# Altium project GCS.PrjPcb
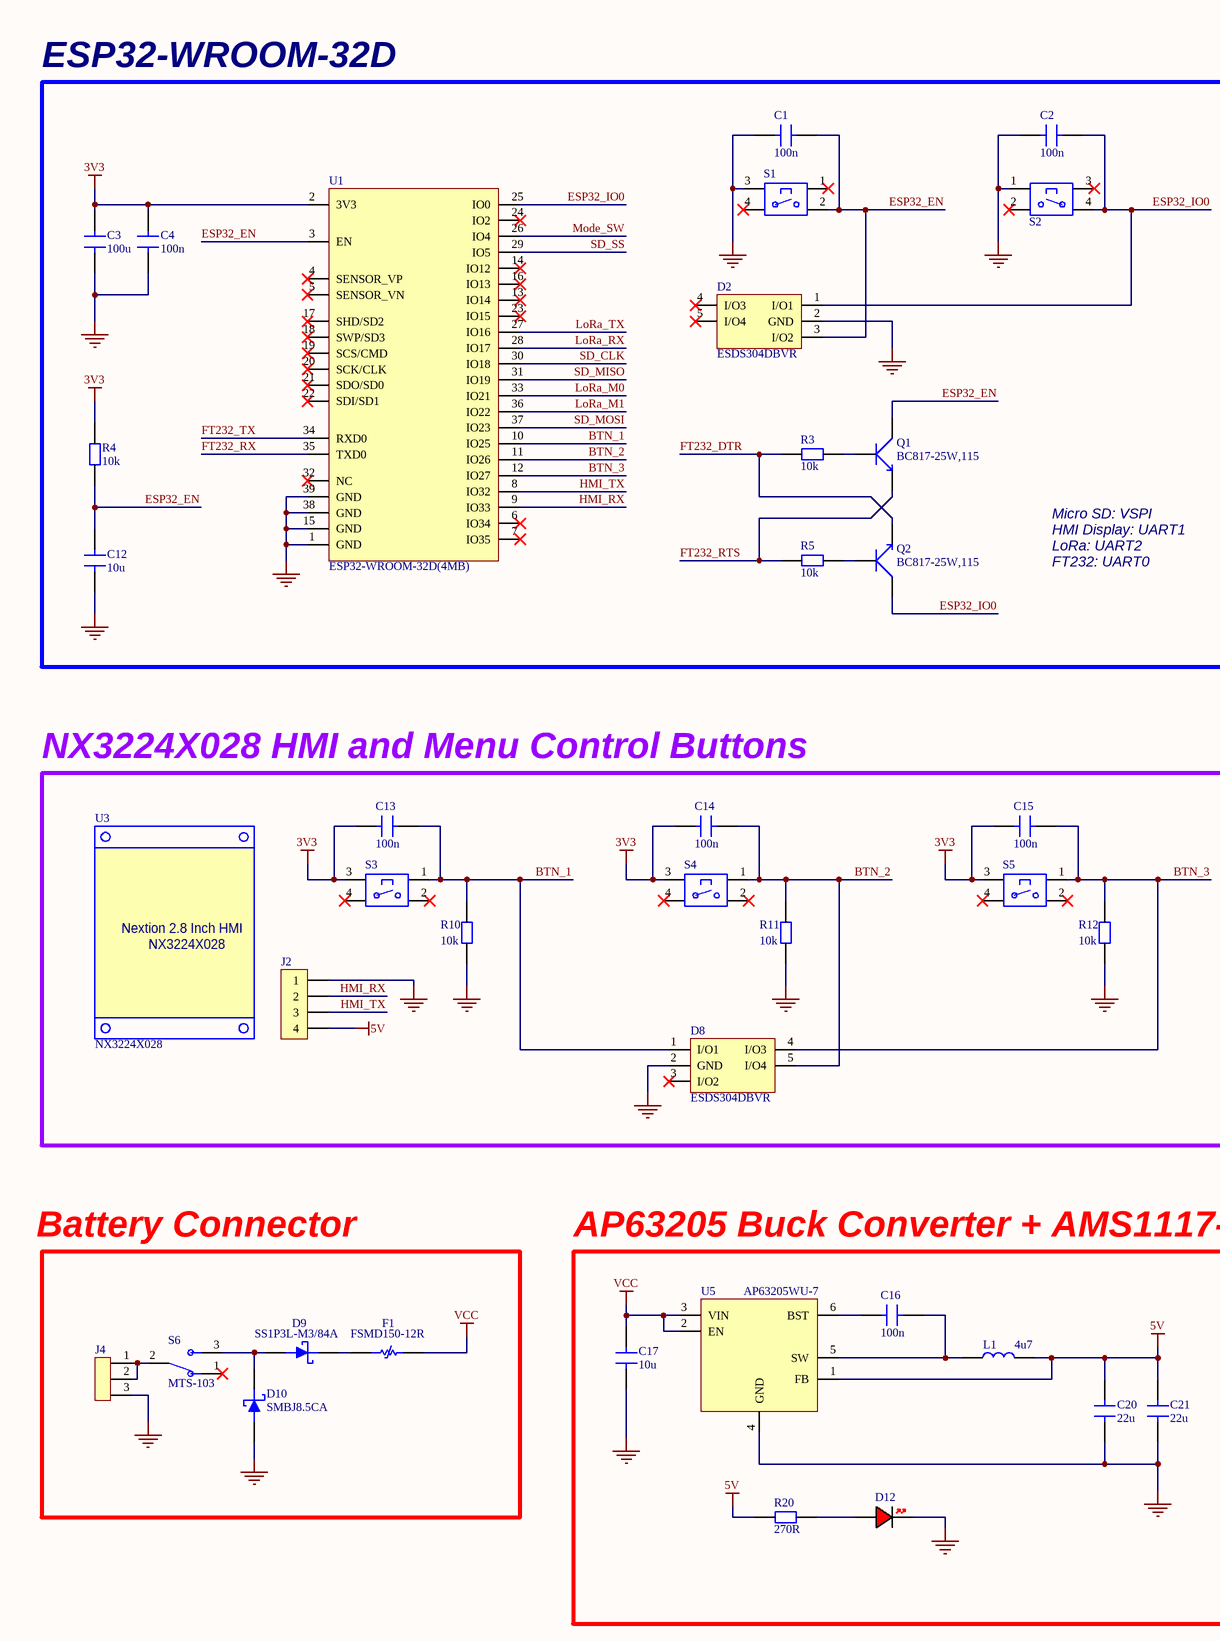
[diagram p0: MainRevB.SchDoc, left]
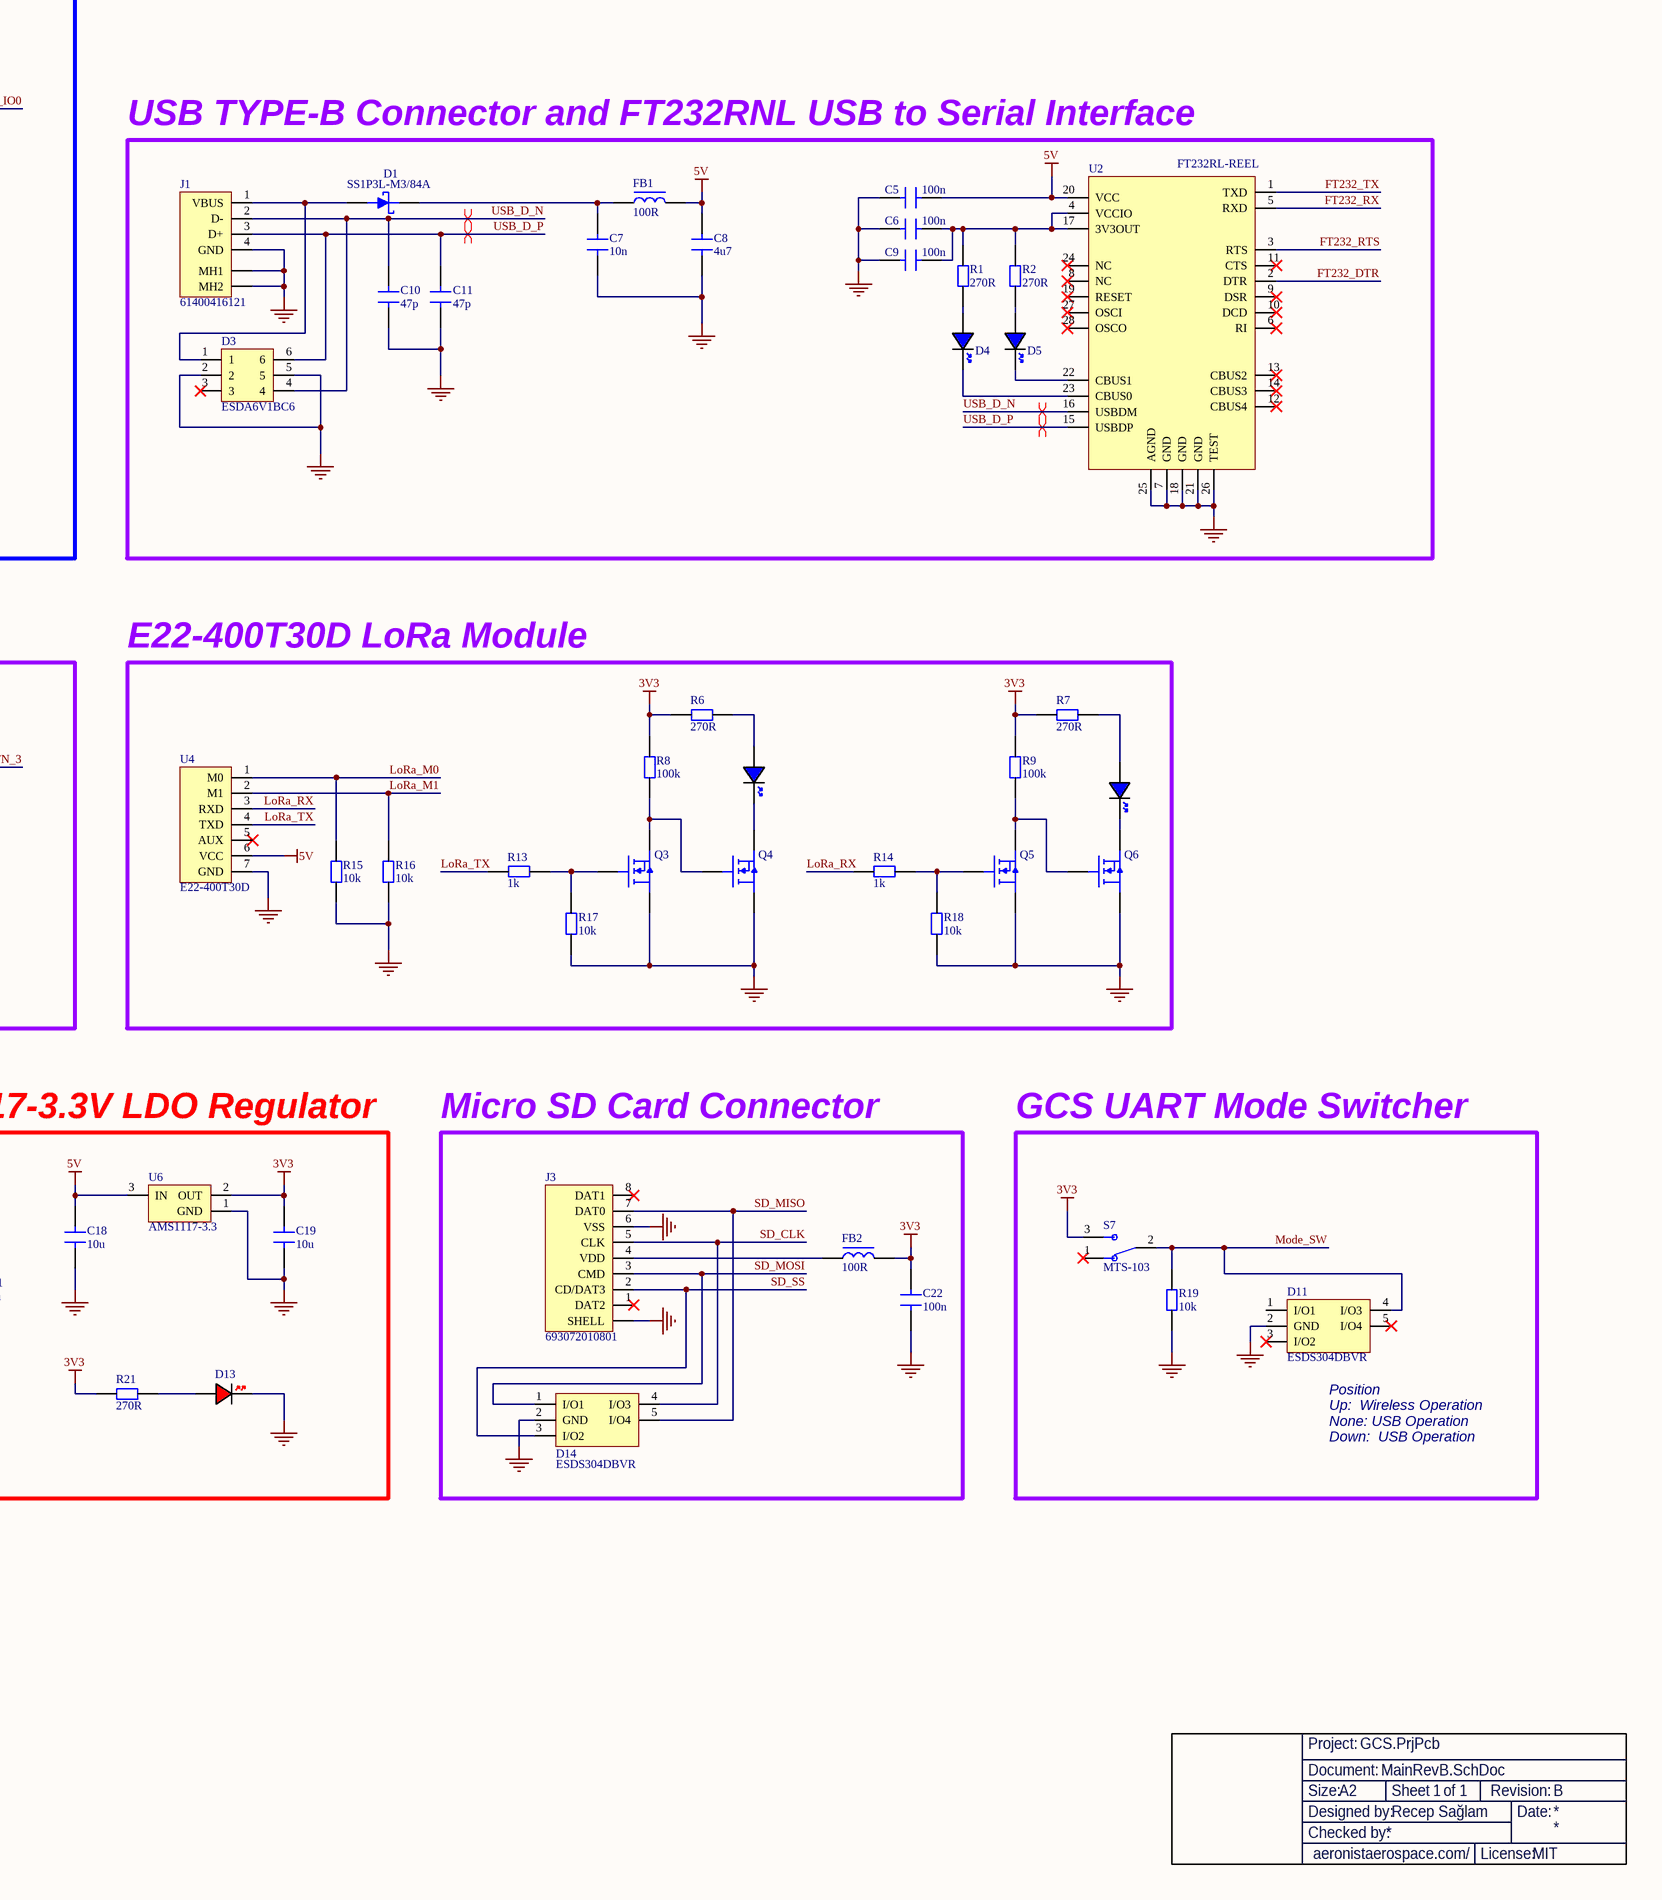
[diagram p1: MainRevB.SchDoc, right]
DrawnBy: Recep Sağlam; License: MIT; Revision: B; Size: A2
1 sheet, 85 parts. Net scope: global (net labels, ports and power ports of the same name join across sheets).
Board file: GCS.PcbDoc

## Sheet MainRevB.SchDoc
size A2; SheetNumber: 1; SheetTotal: 1

### Parts
?  Title Block  (value not drawn)  (graphical)
C1  100n  [CAP 0805]
C2  100n  [CAP 0805]
C3  100u  [CAP 1210]
C4  100n  [CAP 0805]
C5  100n  [CAP 0805]
C6  100n  [CAP 0805]
C7  10n  [CAP 0805]
C8  4u7  [CAP 0805]
C9  100n  [CAP 0805]
C10  47p  [CAP 0805]
C11  47p  [CAP 0805]
C12  10u  [CAP 1210]
C13  100n  [CAP 0805]
C14  100n  [CAP 0805]
C15  100n  [CAP 0805]
C16  100n  [CAP 0805]
C17  10u  [CAP 1210]
C18  10u  [CAP 1210]
C19  10u  [CAP 1210]
C20  22u  [CAP 1210]
C21  22u  [CAP 1210]
C22  100n  [CAP 0805]
D1  SS1P3L-M3/84A  [SS1P3L]
D2  ESDS304DBVR  [SOT-23-5]
D3  ESDA6V1BC6  [SOT-23-6]
D4  LED 0805 BLUE  [LED 0805 BLUE]  (value not drawn)
D5  LED 0805 BLUE  [LED 0805 BLUE]  (value not drawn)
D6  LED 0805 BLUE  [LED 0805 BLUE]  (value not drawn)
D7  LED 0805 BLUE  [LED 0805 BLUE]  (value not drawn)
D8  ESDS304DBVR  [SOT-23-5]
D9  SS1P3L-M3/84A  [SS1P3L]
D10  SMBJ8.5CA  [SMBJ12CA-13-F]
D11  ESDS304DBVR  [SOT-23-5]
D12  LED 0805 RED  [LED 0805 RED]  (value not drawn)
D13  LED 0805 RED  [LED 0805 RED]  (value not drawn)
D14  ESDS304DBVR  [SOT-23-5]
F1  FSMD150-12R  [0ZCG0075FF2C]
FB1  100R  [FB 0805]
FB2  100R  [FB 0805]
J1  61400416121  [61400416121]
J2  JST S4B-PH  [JST_S4B-PH]  (value not drawn)
J3  693072010801  [693072010801]
J4  KF301 3P Terminal  [KF301 3P]  (value not drawn)
L1  4u7  [IHLP2020CZER4R7M11]
Q1  BC817-25W,115  [BC817-25]
Q2  BC817-25W,115  [BC817-25]
Q3  IRLML6344TRPBF  [BC817-25]  (value not drawn)
Q4  IRLML6344TRPBF  [BC817-25]  (value not drawn)
Q5  IRLML6344TRPBF  [BC817-25]  (value not drawn)
Q6  IRLML6344TRPBF  [BC817-25]  (value not drawn)
R1  270R  [RES 0805]
R2  270R  [RES 0805]
R3  10k  [RES 0805]
R4  10k  [RES 0805]
R5  10k  [RES 0805]
R6  270R  [RES 0805]
R7  270R  [RES 0805]
R8  100k  [RES 0805]
R9  100k  [RES 0805]
R10  10k  [RES 0805]
R11  10k  [RES 0805]
R12  10k  [RES 0805]
R13  1k  [RES 0805]
R14  1k  [RES 0805]
R15  10k  [RES 0805]
R16  10k  [RES 0805]
R17  10k  [RES 0805]
R18  10k  [RES 0805]
R19  10k  [RES 0805]
R20  270R  [RES 0805]
R21  270R  [RES 0805]
S1  FSM4JSMATR  [FSM4JSMATR]  (value not drawn)
S2  FSM4JSMATR  [FSM4JSMATR]  (value not drawn)
S3  FSM4JSMATR  [FSM4JSMATR]  (value not drawn)
S4  FSM4JSMATR  [FSM4JSMATR]  (value not drawn)
S5  FSM4JSMATR  [FSM4JSMATR]  (value not drawn)
S6  MTS-103  [MTS-103]
S7  MTS-103  [MTS-103]
U1  ESP32-WROOM-32D(4MB)  [ESP32-WROOM-32]
U2  FT232RL-REEL  [FT232RL]
U3  NX3224X028  [NX32224X028]
U4  E22-400T30D  [LORA E220-400T30D]
U5  AP63205WU-7  [AP63205]
U6  AMS1117-3.3  [SOT-223]

### Blocks framed on the sheet
ESP32-WROOM-32D: C1-C4 C12 D2 Q1 Q2 R3-R5 S1 S2 U1
USB TYPE-B Connector and FT232RNL USB to Serial Interface: C5-C11 D1 D3-D5 FB1 J1 R1 R2 U2
NX3224X028 HMI and Menu Control Buttons: C13-C15 D8 J2 R10-R12 S3-S5
E22-400T30D LoRa Module: D6 D7 Q3-Q6 R6-R9 R13-R18 U4
AP63205 Buck Converter + AMS1117-3.3V LDO Regulator: C16-C21 D12 D13 L1 R20 R21 U5 U6
Micro SD Card Connector: C22 D14 FB2 J3
GCS UART Mode Switcher: D11 R19 S7

### Nets
3V3: C3.2 C4.2 C13.2 C14.1 C15.2 C19.2 C22.1 FB2.2 R4.2 R6.2 R7.2 R8.2 R9.2 R21.1 S3.3 S4.3 S5.3 S7.3 U1.2(3V3) U6.2(OUT)
5V: C5.1 C8.2 C18.2 C20.2 C21.2 FB1.2 J2.4 L1.2 R20.1 U2.20(VCC) U4.6(VCC) U5.1(FB) U6.3(IN)
GND: C1.2 C2.2 C3.1 C4.1 C5.2 C6.2 C7.1 C8.1 C9.2 C10.1 C11.1 C12.1 C17.1 C18.1 C19.1 C20.1 C21.1 C22.2 D2.2(GND) D3.2 D3.5 D8.2(GND) D10.1 D11.2(GND) D12.K D13.K D14.2(GND) J1.4(GND) J1.Shell(MH1) J2.1 J3.6(VSS) J3.SHELL J4.3 Q3.2(S) Q4.2(S) Q5.2(S) Q6.2(S) R10.2 R11.2 R12.2 R15.1 R16.1 R17.2 R18.2 R19.1 S1.3 S2.1 U1.1(GND) U1.15(GND) U1.38(GND) U1.39(GND) U2.7(GND) U2.18(GND) U2.21(GND) U2.25(AGND) U2.26(TEST) U4.7(GND) U5.4(GND) U6.1(GND)
VCC: C17.2 F1.2 U5.2(EN) U5.3(VIN)
BTN_1: C13.1 D8.1(I/O1) R10.1 S3.1 U1.10(IO25)
BTN_2: C14.2 D8.5(I/O4) R11.1 S4.1 U1.11(IO26)
BTN_3: C15.1 D8.4(I/O3) R12.1 S5.1 U1.12(IO27)
ESP32_EN: C1.1 C12.2 D2.3(I/O2) Q1.3(C) R4.1 S1.2 U1.3(EN)
ESP32_IO0: C2.1 D2.1(I/O1) Q2.3(C) S2.4 U1.25(IO0)
FT232_DTR: Q2.2(E) R3.2 U2.2(DTR)
FT232_RTS: Q1.2(E) R5.2 U2.3(RTS)
FT232_RX: U1.35(TXD0) U2.5(RXD)
FT232_TX: U1.34(RXD0) U2.1(TXD)
HMI_RX: J2.2 U1.9(IO33)
HMI_TX: J2.3 U1.8(IO32)
LoRa_M0: R15.2 U1.33(IO21) U4.1(M0)
LoRa_M1: R16.2 U1.36(IO22) U4.2(M1)
LoRa_RX: R14.2 U1.28(IO17) U4.3(RXD)
LoRa_TX: R13.2 U1.27(IO16) U4.4(TXD)
Mode_SW: D11.4(I/O3) R19.2 S7.2 U1.26(IO4)
SD_CLK: D14.4(I/O3) J3.5(CLK) U1.30(IO18)
SD_MISO: D14.5(I/O4) J3.7(DAT0) U1.31(IO19)
SD_MOSI: D14.1(I/O1) J3.3(CMD) U1.37(IO23)
SD_SS: D14.3(I/O2) J3.2(CD/DAT3) U1.29(IO5)
USB_D_N: C10.2 D3.4 J1.2(D-) U2.16(USBDM)
USB_D_P: C11.2 D3.6 J1.3(D+) U2.15(USBDP)
NetC6_1: C6.1 C9.1 R1.1 R2.1 U2.4(VCCIO) U2.17(3V3OUT)
NetC7_2: C7.2 D1.1 FB1.1
NetC16_1: C16.1 L1.1 U5.5(SW)
NetC16_2: C16.2 U5.6(BST)
NetD1_2: D1.2 D3.1 J1.1(VBUS)
NetD4_A: D4.A R1.2
NetD4_K: D4.K U2.23(CBUS0)
NetD5_A: D5.A R2.2
NetD5_K: D5.K U2.22(CBUS1)
NetD6_A: D6.A R6.1
NetD6_K: D6.K Q4.3(D)
NetD7_A: D7.A R7.1
NetD7_K: D7.K Q6.3(D)
NetD9_1: D9.1 F1.1
NetD9_2: D9.2 D10.2 S6.3
NetD12_A: D12.A R20.2
NetD13_A: D13.A R21.2
NetFB2_1: FB2.1 J3.4(VDD)
NetJ4_1: J4.1 J4.2 S6.2
NetQ1_1: Q1.1(B) R3.1
NetQ2_1: Q2.1(B) R5.1
NetQ3_1: Q3.1(G) R13.1 R17.1
NetQ3_3: Q3.3(D) Q4.1(G) R8.1
NetQ5_1: Q5.1(G) R14.1 R18.1
NetQ5_3: Q5.3(D) Q6.1(G) R9.1

Not connected (* = marked no-connect by the designer): D2 4(I/O3)* 5(I/O4)*; D3 3*; D8 3(I/O2)*; D11 1(I/O1) 3(I/O2)* 5(I/O4)*; J3 1(DAT2)* 8(DAT1)*; S1 1* 4*; S2 2* 3*; S3 2* 4*; S4 2* 4*; S5 2* 4*; S6 1*; S7 1*; U1 4(SENSOR_VP)* 5(SENSOR_VN)* 6(IO34)* 7(IO35)* 13(IO14)* 14(IO12)* 16(IO13)* 17(SHD/SD2)* 18(SWP/SD3)* 19(SCS/CMD)* 20(SCK/CLK)* 21(SDO/SD0)* 22(SDI/SD1)* 23(IO15)* 24(IO2)* 32(NC)*; U2 6(RI)* 8(NC)* 9(DSR)* 10(DCD)* 11(CTS)* 12(CBUS4)* 13(CBUS2)* 14(CBUS3)* 19(RESET)* 24(NC)* 27(OSCI)* 28(OSCO)*; U4 5(AUX)*

### Layout directives
differential pair; differential pair class DIFF_USB: USB_D_N, USB_D_P

### Notes on the sheet
- Micro SD: VSPI
- HMI Display: UART1
- LoRa: UART2
- FT232: UART0
- Battery Connector
- (near D11) Position
- Up:  Wireless Operation
- None: USB Operation
- Down:  USB Operation
- (in symbol NX3224X028) Nextion 2.8 Inch HMI
- (in symbol Title Block) Project:; Document:; Size:; Sheet; of; Revision:; Designed by:; Date:; Checked by:; aeronistaerospace.com/; License:

### Library data of the parts
C1 C2 C4-C11 C13-C16 C22 = CAP 0805 50V: Capacitor SMD 0805 50V
C3 = CAP 1210 25V: Capacitor SMD 1210 6V3
C12 C17-C19 = CAP 1210 50V: Capacitor SMD 1210 50V
C20 C21 = CAP 1210 25V: Capacitor SMD 1210 25V
D1 D9 = SS1P3L-M3/84A: Rectifier Diode, Schottky, 1 Phase, 1 Element, 1.5A, 30V V(RRM), Silicon, DO-220AA; Manufacturer: Vishay Semiconductors; Supplier 1: Mouser; Manufacturer Part Number: SS1P3L-M3/84A; RoHS: Yes; Category: Rectifier Diodes; Stock 1: 18484; Pricing 1: 1=0,46, 10=0,299, 50=0,299, 100=0,164, 1000=0,14, 10000=0,103 (USD); Reverse Voltage: 30V; ComponentLink1URL: https://datasheet.ciiva.com/16217/ss1p3l-16217789.pdf?src-supplier=Future+Electronics; ComponentLink1Description: https://datasheet.ciiva.com/16217/ss1p3l-16217789.pdf?src-supplier=Future+Electronics
D2 D8 D11 D14 = ESDS304DBVR: Trans Voltage Suppressor Diode, 85W, 3.6V V(RWM), Unidirectional, 4 Element, Silicon; Manufacturer: Texas Instruments; Supplier: Mouser; Supplier Part Number: 595-ESDS304DBVR; Manufacturer Part Number: ESDS304DBVR; RoHS: Yes; Category: TVS Diodes; Stock: 132; Pricing: 1=0,45, 10=0,304, 50=0,304, 100=0,282, 1000=0,202, 10000=0,15 (USD); Terminal Finish: Tin; JESD-609 Code: e3; Diode Type: TRANS VOLTAGE SUPPRESSOR; Moisture Sensitivity Level: 1; Reach SVHC Compliant: Yes; RoHS Compliant: Yes; ComponentLink1URL: https://www.ti.com:443/lit/ds/symlink/esds302.pdf?src-supplier=IHS+Markit; ComponentLink1Description: https://www.ti.com:443/lit/ds/symlink/esds302.pdf?src-supplier=IHS+Markit; ComponentLink2URL: http://www.ti.com/lit/ds/symlink/esds302.pdf?src-supplier=Digikey; ComponentLink2Description: http://www.ti.com/lit/ds/symlink/esds302.pdf?src-supplier=Digikey
D3 = ESDA6V1BC6: Trans Voltage Suppressor Diode, 80W, 5V V(RWM), Bidirectional, 4 Element, Silicon; Manufacturer: STMicroelectronics; Package Body Material: Plastic; Max Breakdown Voltage: 8V; Min Breakdown Voltage: 6.1V; Number of Elements: 4; Time @ Peak Reflow Temperature-Max (s): 30s; Qualification Status: Not Qualified; Supplier: Arrow Electronics; Supplier Part Number: ESDA6V1BC6; Manufacturer Part Number: ESDA6V1BC6; RoHS: Yes; Category: TVS Diodes; Stock: 84000; Pricing: 3000=0,1532 (USD); Pins: 6; Diode Element Material: SILICON; Package Shape: Rectangular; Terminal Finish: Nickel; Max Operating Temperature: 150°C; JESD-609 Code: e4; Polarity: Bidirectional; Diode Type: TRANS VOLTAGE SUPPRESSOR; JESD-30 Code: R-PDSO-G6; Moisture Sensitivity Level: 1; Non-rep Peak Rev Power Dis-Max: 80W; Package Style: SMALL OUTLINEMeter; Peak Reflow Temperature (Cel): 260°C; Rep Pk Reverse Voltage-Max: 5V; Surface Mount: Yes; Technology: AVALANCHE; Terminal Form: Gull Wing; Terminal Position: DUAL; Reach SVHC Compliant: Yes; RoHS Compliant: Yes; ComponentLink1URL: https://datasheet.ciiva.com:443/pdfs/VipMasterIC/IC/SGST/SGSTS47549/SGSTS47549-1.pdf?src-supplier=IHS+Markit; ComponentLink1Description: https://datasheet.ciiva.com:443/pdfs/VipMasterIC/IC/SGST/SGSTS47549/SGSTS47549-1.pdf?src-supplier=IHS+Markit; ComponentLink2URL: https://datasheet.ciiva.com/14186/esda6v1bc6-st-eng-tds-14186554.pdf?src-supplier=Distrelec; ComponentLink2Description: https://datasheet.ciiva.com/14186/esda6v1bc6-st-eng-tds-14186554.pdf?src-supplier=Distrelec; ComponentLink3URL: https://datasheet.ciiva.com/4507/cd00001906-94538-4507893.pdf?src-supplier=Mouser; ComponentLink3Description: https://datasheet.ciiva.com/4507/cd00001906-94538-4507893.pdf?src-supplier=Mouser; ComponentLink4URL: https://datasheet.ciiva.com/15143/getdatasheetpartid-148472-15143793.pdf?src-supplier=Verical; ComponentLink4Description: https://datasheet.ciiva.com/15143/getdatasheetpartid-148472-15143793.pdf?src-supplier=Verical; ComponentLink5URL: https://datasheet.ciiva.com/7662/1671767-7662124.pdf?src-supplier=Element14; ComponentLink5Description: https://datasheet.ciiva.com/7662/1671767-7662124.pdf?src-supplier=Element14; ComponentLink6URL: https://datasheet.ciiva.com/338/cd00001906-338704.pdf?src-supplier=Digikey; ComponentLink6Description: https://datasheet.ciiva.com/338/cd00001906-338704.pdf?src-supplier=Digikey; ComponentLink7URL: https://datasheet.ciiva.com/338/cd00001906-338705.pdf?src-supplier=Digikey; ComponentLink7Description: https://datasheet.ciiva.com/338/cd00001906-338705.pdf?src-supplier=Digikey; ComponentLink8URL: https://datasheet.ciiva.com/11194/cd00001906-11194053.pdf?src-supplier=Avnet; ComponentLink8Description: https://datasheet.ciiva.com/11194/cd00001906-11194053.pdf?src-supplier=Avnet
D4-D7 = LED 0805 BLUE: LED 0805 GREEN SMD
D10 = SMBJ8.5CA: Diode TVS Single Bi-Dir 8.5V 600W 2-Pin SMB; Manufacturer: Bourns; Number of Bidirectional Channels: 1; Min Breakdown Voltage: 9.44V; Clamping Voltage: 137V; Power Line Protection: No; Breakdown Voltage: 10.8V; Polarity: Bidirectional; Peak Pulse Current: 41.7A; Diode Type: ZENER; Reverse Breakdown Voltage: 94.4V; Operating Supply Voltage: 3.5V; Max Surge Current: 100A; Max Reverse Leakage Current: 40uA; Test Current: 1mA; Leakage Current: 1uA; Supplier 1: Avnet; Manufacturer Part Number: SMBJ8.5CA; RoHS: Yes; Category: TVS Diodes; Pricing 1: 12000=0,0994, 18000=0,0973, 30000=0,0952, 60000=0,0931, 120000=0,091, 600000=0,0889, 1200000=0,0875 (USD); Mount: Surface Mount; Case/Package: DO-214AA; Number of Pins: 2; Min Operating Temperature: -55°C; Max Operating Temperature: 150°C; Packaging: Tape and Reel; Reverse Standoff Voltage: 8.5V; Peak Pulse Power: 600W; Series: SMBJ; Direction: Bidirectional; Number of Channels: 1; Number of Elements: 1; Max Breakdown Voltage: 10.8V; Max Power Dissipation: 600W; Termination: SMD/SMT; Radiation Hardening: No; Reach SVHC Compliant: No; RoHS Compliant: Yes; ComponentLink1URL: https://datasheet.ciiva.com/4510/smbj-51809-4510857.pdf?src-supplier=Mouser; ComponentLink1Description: https://datasheet.ciiva.com/4510/smbj-51809-4510857.pdf?src-supplier=Mouser; ComponentLink2URL: https://datasheet.ciiva.com/3022/smbj-3022665.pdf?src-supplier=Avnet; ComponentLink2Description: https://datasheet.ciiva.com/3022/smbj-3022665.pdf?src-supplier=Avnet; ComponentLink3URL: https://datasheet.ciiva.com/3022/smbj-3022666.pdf?src-supplier=Avnet; ComponentLink3Description: https://datasheet.ciiva.com/3022/smbj-3022666.pdf?src-supplier=Avnet; ComponentLink4URL: https://datasheet.ciiva.com/334/smbj-334791.pdf?src-supplier=Digikey; ComponentLink4Description: https://datasheet.ciiva.com/334/smbj-334791.pdf?src-supplier=Digikey; ComponentLink5URL: https://datasheet.ciiva.com/334/smbj-334792.pdf?src-supplier=Digikey; ComponentLink5Description: https://datasheet.ciiva.com/334/smbj-334792.pdf?src-supplier=Digikey; ComponentLink6URL: https://datasheet.ciiva.com/334/smbj-334790.pdf?src-supplier=Digikey; ComponentLink6Description: https://datasheet.ciiva.com/334/smbj-334790.pdf?src-supplier=Digikey; ComponentLink7URL: https://datasheet.ciiva.com/3022/smbj-3022670.pdf?src-supplier=Avnet; ComponentLink7Description: https://datasheet.ciiva.com/3022/smbj-3022670.pdf?src-supplier=Avnet; ComponentLink8URL: https://datasheet.ciiva.com/334/smbj-334764.pdf?src-supplier=Digikey; ComponentLink8Description: https://datasheet.ciiva.com/334/smbj-334764.pdf?src-supplier=Digikey; ComponentLink9URL: https://datasheet.ciiva.com/334/smbj-334765.pdf?src-supplier=Digikey; ComponentLink9Description: https://datasheet.ciiva.com/334/smbj-334765.pdf?src-supplier=Digikey; ComponentLink10URL: https://datasheet.ciiva.com/334/smbj-334763.pdf?src-supplier=Digikey; ComponentLink10Description: https://datasheet.ciiva.com/334/smbj-334763.pdf?src-supplier=Digikey
D12 D13 = LED 0805 RED: LED 0805 RED SMD
F1 = 0ZCG0150BF2C: PTC RESTTBLE 1.50A 24V CHIP 1812; Manufacturer: Bel; Current Rating: 100A; Supplier 1: Avnet; Manufacturer Part Number: 0ZCG0150BF2C; RoHS: Yes; Category: PTC Resettable Fuses; Stock 1: 20000; Pricing 1: 2000=0,10628, 4000=0,10217, 8000=0,09874, 12000=0,09531, 16000=0,09188, 20000=0,08846, 200000=0,06138 (USD); Voltage Rating: 24V; Height: 1.55mm; ComponentLink1URL: http://www.farnell.com/datasheets/2571640.pdf?src-supplier=Farnell; ComponentLink1Description: http://www.farnell.com/datasheets/2571640.pdf?src-supplier=Farnell; ComponentLink2URL: http://www.farnell.com/datasheets/2571640.pdf?src-supplier=Element14; ComponentLink2Description: http://www.farnell.com/datasheets/2571640.pdf?src-supplier=Element14; ComponentLink3URL: https://www.belfuse.com/resources/CircuitProtection/datasheets/0ZCG%20Nov2016.pdf?src-supplier=Digikey; ComponentLink3Description: https://www.belfuse.com/resources/CircuitProtection/datasheets/0ZCG%20Nov2016.pdf?src-supplier=Digikey; ComponentLink4URL: http://www.farnell.com/datasheets/2571640.pdf?src-supplier=Newark; ComponentLink4Description: http://www.farnell.com/datasheets/2571640.pdf?src-supplier=Newark; ComponentLink5URL: http://www.belfuse.com/pdfs/0ZCG.pdf?src-supplier=Avnet; ComponentLink5Description: http://www.belfuse.com/pdfs/0ZCG.pdf?src-supplier=Avnet; ComponentLink6URL: https://datasheet.octopart.com/0ZCG0150BF2C-Bel-Fuse-datasheet-138895723.pdf?src-supplier=Electro+Sonic; ComponentLink6Description: https://datasheet.octopart.com/0ZCG0150BF2C-Bel-Fuse-datasheet-138895723.pdf?src-supplier=Electro+Sonic
FB1 FB2 = FB 0805: Ferrite Bead SMD 0805
J1 = 61400416121: USB Connector, 4 Contact(s), Female, Right Angle, Solder Terminal, Locking, Receptacle; Manufacturer: Wurth Electronics; Connector Type: TELECOM AND DATACOM CONNECTOR; Option: General Purpose; Contact Resistance: 20mR; Durability: 1500Cycles; Empty Shell: No; Number Of Connectors: 1; Number Of PCB Rows: 2; PCB Contact Pattern: RECTANGULAR; Polarization Key: POLARIZED HOUSING; Number of Contacts: 4; Additional Feature: ROHS COMPLIANT; Board Mounting Option: SOLDERABLE RETENTION CLIPS; Dielectric Withstanding Voltage (AC): 750V; Insulation Resistance: 1GR; Rated Current (Signal): 1.5A; Body Depth: 0.65inch; Body Length: 0.472inch; Body Breadth: 0.421inch; PCB Contact Row Spacing: 2.0066mm; Reference Standard: UL; Reliability: COMMERCIAL; Supplier: Mouser; Supplier Part Number: 710-61400416121; Manufacturer Part Number: 61400416121; RoHS: Yes; Category: USB Connectors; Stock: 3231; Pricing: 1=1,41, 10=1,24, 50=1,17, 100=1,05, 1000=1,01, 10000=1,01 (USD); Mounting Technology: Board; Contact Finish - Mating: GOLD; Contact Finish - Termination: Gold (Au); Insulation Material: Polybutylene; Shell Finish: Nickel; Shell Material: Bronze; Contact Material: Copper Alloy; Min Operating Temperature: -40°C; Max Operating Temperature: 105°C; JESD-609 Code: e4; Body/Shell Style: RECEPTACLE; Contact Gender: Female; Contact Style: USB; Filter Feature: No; Mixed Contacts: No; Mounting Style: RIGHT ANGLE; Termination: Solder; Mating Information: NO; Mounting Option 1: LOCKING; Terminal Pitch: 2.4892mm; Terminal Length: 0.126inch; Flammability Rating: UL94 V-0; DIN Conformance: No; IEC Conformance: No; MIL Conformance: No; Reach SVHC Compliant: Yes; RoHS Compliant: Yes; ComponentLink1URL: https://datasheet.ciiva.com:443/pdfs/VipMasterIC/IC/MIDC/MIDC-S-A0004022663/MIDC-S-A0006489655-1.pdf?src-supplier=IHS+Markit; ComponentLink1Description: https://datasheet.ciiva.com:443/pdfs/VipMasterIC/IC/MIDC/MIDC-S-A0004022663/MIDC-S-A0006489655-1.pdf?src-supplier=IHS+Markit; ComponentLink2URL: https://datasheet.ciiva.com/1098/1697135-1098929.pdf?src-supplier=Element14; ComponentLink2Description: https://datasheet.ciiva.com/1098/1697135-1098929.pdf?src-supplier=Element14; ComponentLink3URL: https://datasheet.ciiva.com/1100/76589-1100560.pdf?src-supplier=Newark; ComponentLink3Description: https://datasheet.ciiva.com/1100/76589-1100560.pdf?src-supplier=Newark; ComponentLink4URL: https://datasheet.ciiva.com/4598/61400416121-69623-4598782.pdf?src-supplier=Mouser; ComponentLink4Description: https://datasheet.ciiva.com/4598/61400416121-69623-4598782.pdf?src-supplier=Mouser; ComponentLink5URL: https://datasheet.ciiva.com/851/61400416121-851771.pdf?src-supplier=Digikey; ComponentLink5Description: https://datasheet.ciiva.com/851/61400416121-851771.pdf?src-supplier=Digikey; ComponentLink6URL: https://datasheet.ciiva.com/11731/0900766b81023ab5-11731301.pdf?src-supplier=Rs; ComponentLink6Description: https://datasheet.ciiva.com/11731/0900766b81023ab5-11731301.pdf?src-supplier=Rs; ComponentLink7URL: https://datasheet.ciiva.com/14118/4257098-eng-datasheet-14118442.pdf?src-supplier=Distrelec; ComponentLink7Description: https://datasheet.ciiva.com/14118/4257098-eng-datasheet-14118442.pdf?src-supplier=Distrelec; ComponentLink8URL: https://datasheet.ciiva.com/48712/001088208-da-01-en-wr-com-usb-type-b-61400416121-48712662.pdf?src-supplier=Conrad; ComponentLink8Description: https://datasheet.ciiva.com/48712/001088208-da-01-en-wr-com-usb-type-b-61400416121-48712662.pdf?src-supplier=Conrad
J2 = JST S4B-PH: Connector Header, PH Series, 4 Position, Side Entry, 2.00mm, Solder, Surface Mount, Natural.; Manufacturer Part Number: S4B-PH-SM4-TB(LF)(SN; Supplier: Future Electronics; Supplier Part Number: 1769371; Manufacturer: JST; RoHS: No; Category: Connectors; Stock: 8000; Pricing: 1000=0,32, 3000=0,315, 5000=0,31 (USD); ComponentLink1URL: http://uk.rs-online.com/webdocs/13ce/0900766b813ce4c5.pdf?src-supplier=Rs; ComponentLink1Description: http://uk.rs-online.com/webdocs/13ce/0900766b813ce4c5.pdf?src-supplier=Rs; ComponentLink2URL: https://datasheet.octopart.com/S4B-PH-SM4-TB%28LF%29%28SN%29-JST-datasheet-15068535.pdf?src-supplier=Newark; ComponentLink2Description: https://datasheet.octopart.com/S4B-PH-SM4-TB%28LF%29%28SN%29-JST-datasheet-15068535.pdf?src-supplier=Newark; ComponentLink3URL: https://datasheet.octopart.com/S4B-PH-SM4-TB%28LF%29%28SN%29-JST-datasheet-56537.pdf?src-supplier=Digikey; ComponentLink3Description: https://datasheet.octopart.com/S4B-PH-SM4-TB%28LF%29%28SN%29-JST-datasheet-56537.pdf?src-supplier=Digikey; ComponentLink4URL: https://datasheet.octopart.com/S4B-PH-SM4-TB%28LF%29%28SN%29-JST-datasheet-15068535.pdf?src-supplier=SOS+electronic; ComponentLink4Description: https://datasheet.octopart.com/S4B-PH-SM4-TB%28LF%29%28SN%29-JST-datasheet-15068535.pdf?src-supplier=SOS+electronic; ComponentLink5URL: https://datasheet.octopart.com/S4B-PH-SM4-TB%28LF%29%28SN%29-JST-datasheet-147762421.pdf?src-supplier=LKR; ComponentLink5Description: https://datasheet.octopart.com/S4B-PH-SM4-TB%28LF%29%28SN%29-JST-datasheet-147762421.pdf?src-supplier=LKR
J3 = 693072010801: PCB Connector, 8 Contact(s), 1 Row(s), Male, Right Angle, 0.043 inch Pitch, Surface Mount Terminal, Black Insulator, Receptacle; Manufacturer: Wurth Electronics; Board Mounting Option: SOLDER HOLDING POSTS; Contact Pattern: RECTANGULAR; Contact Resistance: 100mR; Dielectric Withstanding Voltage (AC): 500V; Durability: 10000Cycles; Insulation Resistance: 1GR; Number Of Connectors: 1; Rated Current (Signal): 500mA; Number of Contacts: 8; Body Breadth: 0.069inch; Body Depth: 0.539inch; Body Length: 0.535inch; Reference Standard: UL; Reliability: COMMERCIAL; Supplier: Mouser; Supplier Part Number: 710-693072010801; Manufacturer Part Number: 693072010801; RoHS: Yes; Category: Memory Connectors; Stock: 2877; Pricing: 1=3,48, 10=3,41, 50=3, 100=2,87, 1000=2,46, 10000=2,26 (USD); Mounting Technology: Board; Contact Finish - Mating: NOT SPECIFIED; Insulation Color: Black; Insulation Material: Polymer; Min Operating Temperature: -25°C; Max Operating Temperature: 85°C; Connector Type: PCB; Body/Shell Style: RECEPTACLE; Contact Gender: Male; Mounting Style: RIGHT ANGLE; Number Of PCB Rows: 1; Number of Ports: 1; Number of Rows Loaded: 1; PCB Contact Pattern: RECTANGULAR; Termination: SMD/SMT; Mating Contact Pitch: 0.043inch; Terminal Pitch: 1.0922mm; Reach SVHC Compliant: Yes; RoHS Compliant: Yes; ComponentLink1URL: https://datasheet.ciiva.com:443/pdfs/VipMasterIC/IC/MIDC/MIDC-S-A0000106158/MIDC-S-A0000106158-1.pdf?src-supplier=IHS+Markit; ComponentLink1Description: https://datasheet.ciiva.com:443/pdfs/VipMasterIC/IC/MIDC/MIDC-S-A0000106158/MIDC-S-A0000106158-1.pdf?src-supplier=IHS+Markit; ComponentLink2URL: https://datasheet.ciiva.com/1107/693072010801-1107219.pdf?src-supplier=Newark; ComponentLink2Description: https://datasheet.ciiva.com/1107/693072010801-1107219.pdf?src-supplier=Newark; ComponentLink3URL: https://datasheet.ciiva.com/25605/0900766b81113f29-25605360.pdf?src-supplier=Rs; ComponentLink3Description: https://datasheet.ciiva.com/25605/0900766b81113f29-25605360.pdf?src-supplier=Rs; ComponentLink4URL: https://datasheet.ciiva.com/1104/693072010801-1104797.pdf?src-supplier=Element14; ComponentLink4Description: https://datasheet.ciiva.com/1104/693072010801-1104797.pdf?src-supplier=Element14; ComponentLink5URL: https://datasheet.ciiva.com/6935/693072010801-6935071.pdf?src-supplier=Digikey; ComponentLink5Description: https://datasheet.ciiva.com/6935/693072010801-6935071.pdf?src-supplier=Digikey; ComponentLink6URL: https://datasheet.ciiva.com/6935/693072010801-6935068.pdf?src-supplier=Digikey; ComponentLink6Description: https://datasheet.ciiva.com/6935/693072010801-6935068.pdf?src-supplier=Digikey
J4 = KF301 3P Terminal: 3 Pin Screw Terminal Block 5mm
L1 = IHLP2020CZER4R7M11: Inductor Power Shielded Wirewound 4.7uH 20% 100KHz Powdered Iron 4.5A 60mOhm DCR 2020 T/R; Manufacturer: Vishay; Supplier 1: Mouser; Manufacturer Part Number: IHLP2020CZER4R7M11; RoHS: No; Category: Fixed Inductors; Stock 1: 10031; Pricing 1: 1=1,19, 10=1,02, 50=1,02, 100=0,828, 1000=0,828, 10000=0,473 (USD); ComponentLink1URL: https://datasheet.ciiva.com/14803/lp20cz11-14803040.pdf?src-supplier=Arrow+Electronics; ComponentLink1Description: https://datasheet.ciiva.com/14803/lp20cz11-14803040.pdf?src-supplier=Arrow+Electronics; ComponentLink2URL: https://datasheet.ciiva.com/11798/0900766b8102c930-11798346.pdf?src-supplier=Rs; ComponentLink2Description: https://datasheet.ciiva.com/11798/0900766b8102c930-11798346.pdf?src-supplier=Rs; ComponentLink3URL: https://datasheet.ciiva.com/22694/480942-22694470.pdf?src-supplier=Element14; ComponentLink3Description: https://datasheet.ciiva.com/22694/480942-22694470.pdf?src-supplier=Element14; ComponentLink4URL: https://datasheet.ciiva.com/8017/480942-8017228.pdf?src-supplier=Element14; ComponentLink4Description: https://datasheet.ciiva.com/8017/480942-8017228.pdf?src-supplier=Element14; ComponentLink5URL: https://datasheet.ciiva.com/8494/lp20cz11-8494950.pdf?src-supplier=Avnet; ComponentLink5Description: https://datasheet.ciiva.com/8494/lp20cz11-8494950.pdf?src-supplier=Avnet; ComponentLink6URL: https://datasheet.ciiva.com/17112/70205433-17112327.pdf?src-supplier=Allied+Electronics; ComponentLink6Description: https://datasheet.ciiva.com/17112/70205433-17112327.pdf?src-supplier=Allied+Electronics; ComponentLink7URL: https://datasheet.ciiva.com/6688/lp20cz11-6688326.pdf?src-supplier=Digikey; ComponentLink7Description: https://datasheet.ciiva.com/6688/lp20cz11-6688326.pdf?src-supplier=Digikey; ComponentLink8URL: https://datasheet.ciiva.com/6688/lp20cz11-6688327.pdf?src-supplier=Digikey; ComponentLink8Description: https://datasheet.ciiva.com/6688/lp20cz11-6688327.pdf?src-supplier=Digikey; ComponentLink9URL: https://datasheet.ciiva.com/6688/lp20cz11-6688329.pdf?src-supplier=Digikey; ComponentLink9Description: https://datasheet.ciiva.com/6688/lp20cz11-6688329.pdf?src-supplier=Digikey
Q1 Q2 = BC817-25W,115: BC817 Series 45 V 500 mA NPN General Purpose Transistor - SOT-23; Manufacturer: Nexperia; Supplier 1: Future Electronics; Manufacturer Part Number: BC817-25W,115; RoHS: Yes; Category: BJTs; Stock 1: 99000; Pricing 1: 3000=0,0169, 12000=0,0162, 45000=0,0155, 90000=0,0152, 225000=0,0144 (USD); ComponentLink1URL: https://datasheet.octopart.com/BC817-25W%2C115-NXP-datasheet-29749.pdf?src-supplier=Future+Electronics; ComponentLink1Description: https://datasheet.octopart.com/BC817-25W%2C115-NXP-datasheet-29749.pdf?src-supplier=Future+Electronics; ComponentLink2URL: http://www.farnell.com/datasheets/699988.pdf?src-supplier=Newark; ComponentLink2Description: http://www.farnell.com/datasheets/699988.pdf?src-supplier=Newark; ComponentLink3URL: https://datasheet.octopart.com/BC817-25W%2C115-Nexperia-datasheet-155782301.pdf?src-supplier=TME; ComponentLink3Description: https://datasheet.octopart.com/BC817-25W%2C115-Nexperia-datasheet-155782301.pdf?src-supplier=TME; Supplier Part Number 1: 5067352
Q3-Q6 = IRLML6344TRPBF: Small Signal Field-Effect Transistor; Manufacturer: Infineon; Package Body Material: Plastic; Transistor Element Material: SILICON; Polarity/Channel Type: N-CHANNEL; Drain Current-Max (Abs) (ID): 5A; Drain-source On Resistance-Max: 29mR; DS Breakdown Voltage-Min: 30V; FET Technology: METAL-OXIDE SEMICONDUCTOR; Number of Elements: 1; Operating Mode: ENHANCEMENT MODE; Power Dissipation-Max (Abs): 1.3W; Pulsed Drain Current-Max (IDM): 25A; Time @ Peak Reflow Temperature-Max (s): 30s; Transistor Application: SWITCHING; JEDEC-95 Code: TO-236AB; Qualification Status: Not Qualified; Supplier: Arrow Electronics; Supplier Part Number: IRLML6344TRPBF; Manufacturer Part Number: IRLML6344TRPBF; RoHS: Yes; Category: MOSFETs; Stock: 9000; Pricing: 3000=0,095, 6000=0,086, 9000=0,0735, 24000=0,0628 (USD); Pins: 3; Package Shape: Rectangular; Terminal Finish: Tin; Max Operating Temperature: 150°C; JESD-609 Code: e3; Drain Current-Max (ID): 5A; JESD-30 Code: R-PDSO-G3; Moisture Sensitivity Level: 1; Package Style: SMALL OUTLINEMeter; Peak Reflow Temperature (Cel): 260°C; Surface Mount: Yes; Terminal Form: Gull Wing; Terminal Position: DUAL; Reach SVHC Compliant: Yes; RoHS Compliant: Yes; ComponentLink1URL: https://datasheet.ciiva.com:443/pdfs/VipMasterIC/IC/IRSD/IRSD-S-A0000281304/IRSD-S-A0000281304-1.pdf?src-supplier=IHS+Markit; ComponentLink1Description: https://datasheet.ciiva.com:443/pdfs/VipMasterIC/IC/IRSD/IRSD-S-A0000281304/IRSD-S-A0000281304-1.pdf?src-supplier=IHS+Markit; ComponentLink2URL: http://www.farnell.com/datasheets/1911844.pdf?src-supplier=Farnell; ComponentLink2Description: http://www.farnell.com/datasheets/1911844.pdf?src-supplier=Farnell; ComponentLink3URL: https://datasheet.octopart.com/IRLML6344TRPBF-Infineon-datasheet-10031181.pdf?src-supplier=Farnell; ComponentLink3Description: https://datasheet.octopart.com/IRLML6344TRPBF-Infineon-datasheet-10031181.pdf?src-supplier=Farnell; ComponentLink4URL: https://www.infineon.com/dgdl/irlml6344pbf.pdf?fileId=5546d462533600a4015356689c44262c&src-supplier=Mouser; ComponentLink4Description: https://www.infineon.com/dgdl/irlml6344pbf.pdf?fileId=5546d462533600a4015356689c44262c&src-supplier=Mouser; ComponentLink5URL: https://www.infineon.com/dgdl/irlml6344pbf.pdf?fileId=5546d462533600a4015356689c44262c&src-supplier=Digikey; ComponentLink5Description: https://www.infineon.com/dgdl/irlml6344pbf.pdf?fileId=5546d462533600a4015356689c44262c&src-supplier=Digikey; ComponentLink6URL: https://www.infineon.com/dgdl/irlml6344pbf.pdf?fileId=5546d462533600a4015356689c44262c&src-supplier=Avnet; ComponentLink6Description: https://www.infineon.com/dgdl/irlml6344pbf.pdf?fileId=5546d462533600a4015356689c44262c&src-supplier=Avnet; ComponentLink7URL: https://www.infineon.com/dgdl/irlml6344pbf.pdf?fileId=5546d462533600a4015356689c44262c&src-supplier=Rs; ComponentLink7Description: https://www.infineon.com/dgdl/irlml6344pbf.pdf?fileId=5546d462533600a4015356689c44262c&src-supplier=Rs; ComponentLink8URL: https://www.infineon.com/dgdl/irlml6344pbf.pdf?fileId=5546d462533600a4015356689c44262c&src-supplier=Rutronik; ComponentLink8Description: https://www.infineon.com/dgdl/irlml6344pbf.pdf?fileId=5546d462533600a4015356689c44262c&src-supplier=Rutronik; ComponentLink9URL: https://www.infineon.com/dgdl/irlml6344pbf.pdf?fileId=5546d462533600a4015356689c44262c&src-supplier=TME; ComponentLink9Description: https://www.infineon.com/dgdl/irlml6344pbf.pdf?fileId=5546d462533600a4015356689c44262c&src-supplier=TME; ComponentLink10URL: https://www.infineon.com/dgdl/irlml6344pbf.pdf?fileId=5546d462533600a4015356689c44262c&src-supplier=Quest; ComponentLink10Description: https://www.infineon.com/dgdl/irlml6344pbf.pdf?fileId=5546d462533600a4015356689c44262c&src-supplier=Quest; ComponentLink11URL: https://www.infineon.com/dgdl/irlml6344pbf.pdf?fileId=5546d462533600a4015356689c44262c&src-supplier=Conrad; ComponentLink11Description: https://www.infineon.com/dgdl/irlml6344pbf.pdf?fileId=5546d462533600a4015356689c44262c&src-supplier=Conrad
R1-R21 = RES 0805: Resistor SMD 0805
S1-S5 = FSM4JSMATR: Switch Tactile OFF (ON) SPST Round Button Gull Wing 0.05A 24VDC 1.57N SMD T/R; Manufacturer: TE Connectivity Alcoswitch; Supplier 1: Digi-Key; Manufacturer Part Number: FSM4JSMATR; RoHS: Yes; Category: Pushbutton Switches; Stock 1: 84996; Pricing 1: 1=0,36, 10=0,351, 25=0,33, 100=0,2866, 250=0,26, 500=0,24188 (USD); ComponentLink1URL: https://datasheet.ciiva.com/16320/eng-cs-1308111-1-switches-core-program-catalog-0308-16320065.pdf?src-supplier=Future+Electronics; ComponentLink1Description: https://datasheet.ciiva.com/16320/eng-cs-1308111-1-switches-core-program-catalog-0308-16320065.pdf?src-supplier=Future+Electronics; ComponentLink2URL: https://datasheet.ciiva.com/1530/1683375-1530944.pdf?src-supplier=Element14; ComponentLink2Description: https://datasheet.ciiva.com/1530/1683375-1530944.pdf?src-supplier=Element14; ComponentLink3URL: https://datasheet.ciiva.com/23765/1486934-23765878.pdf?src-supplier=Newark; ComponentLink3Description: https://datasheet.ciiva.com/23765/1486934-23765878.pdf?src-supplier=Newark; ComponentLink4URL: https://datasheet.ciiva.com/7638/921681-7638037.pdf?src-supplier=Element14; ComponentLink4Description: https://datasheet.ciiva.com/7638/921681-7638037.pdf?src-supplier=Element14
S6 S7 = MTS-103: Miniature Toggle Switch Single Pole Double Throw SPDT (MTS103) ON-OFF-ON 120VAC 5A 1/4 Inch Mounting
U1 = ESP32-WROOM-32D(4MB): Rx Txrx Mod Wifi Trace Ant SMD; Manufacturer: Espressif Systems; Supplier: Mouser; Supplier Part Number: 356-ESP32WROOM32D4MB; Manufacturer Part Number: ESP32-WROOM-32D(4MB); RoHS: No; Category: LDO
U2 = FT232RL-REEL: IC USB FS SERIAL UART 28-SSOP; Manufacturer: FTDI; Interface: UART,RS-232,RS-422,RS-485; Data Rate: 12Mbps; Number of Channels: 1; Max Supply Voltage: 5.25V; Min Supply Voltage: 3.3V; Operating Supply Current: 15mA; Voltage: 5V; Supplier 1: Arrow Electronics; Manufacturer Part Number: FT232RL-REEL; RoHS: Yes; Category: Interface ICs; Stock 1: 3812; Pricing 1: 1=4,75, 10=4,3, 50=4,1 (USD); Mount: Surface Mount; Case/Package: SSOP; Number of Pins: 28; Weight: 0.080001oz; Min Operating Temperature: -40°C; Max Operating Temperature: 85°C; Packaging: Tape and Reel; Series: USBmadeEZ-UART; Package Quantity: 1; Number of Transceivers: 1; Length: 10.2mm; Width: 5.3mm; Height: 1.75mm; Radiation Hardening: No; Lead Free: Lead Free; RoHS Compliant: Yes; Reach SVHC Compliant: No; ComponentLink1URL: https://datasheet.ciiva.com/34304/2161019-34304054.pdf?src-supplier=Jameco; ComponentLink1Description: https://datasheet.ciiva.com/34304/2161019-34304054.pdf?src-supplier=Jameco; ComponentLink2URL: https://datasheet.ciiva.com/4787/ds-ft232r-11534-4787658.pdf?src-supplier=Mouser; ComponentLink2Description: https://datasheet.ciiva.com/4787/ds-ft232r-11534-4787658.pdf?src-supplier=Mouser; ComponentLink3URL: https://datasheet.ciiva.com/1787/ds-ft232r-1787048.pdf?src-supplier=Digikey; ComponentLink3Description: https://datasheet.ciiva.com/1787/ds-ft232r-1787048.pdf?src-supplier=Digikey; ComponentLink4URL: https://datasheet.ciiva.com/1787/ds-ft232r-1787047.pdf?src-supplier=Digikey; ComponentLink4Description: https://datasheet.ciiva.com/1787/ds-ft232r-1787047.pdf?src-supplier=Digikey; ComponentLink5URL: https://datasheet.ciiva.com/1787/ds-ft232r-1787049.pdf?src-supplier=Digikey; ComponentLink5Description: https://datasheet.ciiva.com/1787/ds-ft232r-1787049.pdf?src-supplier=Digikey; ComponentLink6URL: https://datasheet.ciiva.com/16200/ds-ft232r-16200652.pdf?src-supplier=Future+Electronics; ComponentLink6Description: https://datasheet.ciiva.com/16200/ds-ft232r-16200652.pdf?src-supplier=Future+Electronics; ComponentLink7URL: https://datasheet.ciiva.com/15150/getdatasheetpartid-643207-15150506.pdf?src-supplier=Verical; ComponentLink7Description: https://datasheet.ciiva.com/15150/getdatasheetpartid-643207-15150506.pdf?src-supplier=Verical
U4 = E22-400T30D: SX1268 E22-400T30D LoRa Module Header
U5 = AP63205WU-7: AP63205 Series 32 V 2 A 1.1 MHz Synchronous Buck Converter -TSOT-26; Manufacturer: Diodes; Max Duty Cycle: 100%; Max Supply Voltage: 32V; Min Supply Voltage: 3.8V; Nominal Supply Current: 22uA; Number of Outputs: 1NUMBER; Output Current: 2A; Output Voltage: 5V; Switching Frequency: 1.1MHz; Supplier 1: Future Electronics; Manufacturer Part Number: AP63205WU-7; RoHS: Yes; Category: Voltage Regulators - Switching; Stock 1: 45000; Pricing 1: 3000=0,33, 6000=0,32 (USD); Min Operating Temperature: -40°C; Max Operating Temperature: 85°C; Height: 1mm; ComponentLink1URL: https://www.diodes.com/assets/Datasheets/AP63200-AP63201-AP63203-AP63205.pdf?src-supplier=Digikey; ComponentLink1Description: https://www.diodes.com/assets/Datasheets/AP63200-AP63201-AP63203-AP63205.pdf?src-supplier=Digikey
U6 = AMS1117-3.3: Linear Voltage Regulator IC Positive Fixed 1 Output 1A